# EAGLE design SolarCellX_v2_6milmag (EAGLE 9.2.2)
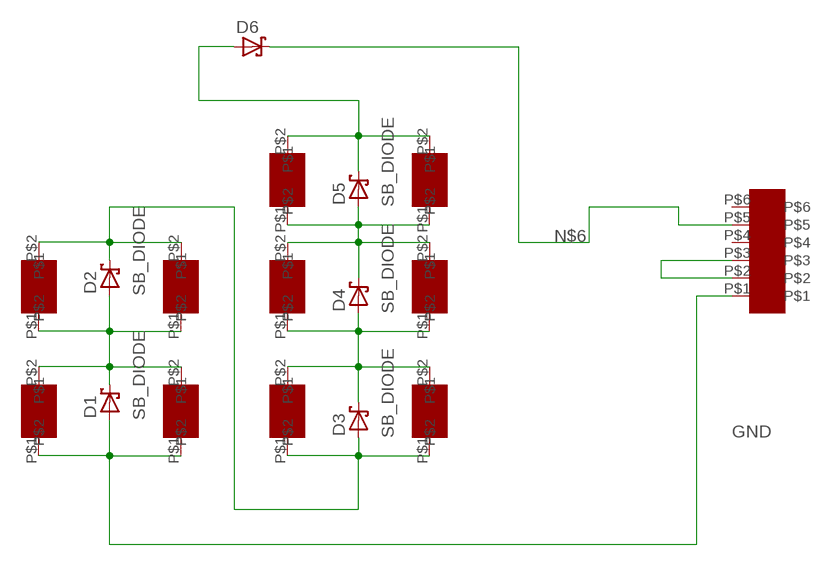
[diagram p0: schematic, sheet 1]

## Parts
1  SLMD121H04L  [SLMD121H04L]
2  SLMD121H04L  [SLMD121H04L]
11  SLMD121H04L  [SLMD121H04L]
12  SLMD121H04L  [SLMD121H04L]
13  SLMD121H04L  [SLMD121H04L]
14  SLMD121H04L  [SLMD121H04L]
21  SLMD121H04L  [SLMD121H04L]
22  SLMD121H04L  [SLMD121H04L]
23  SLMD121H04L  [SLMD121H04L]
24  SLMD121H04L  [SLMD121H04L]
D1  SB_DIODE  [SB_DIODE]
D2  SB_DIODE  [SB_DIODE]
D3  SB_DIODE  [SB_DIODE]
D4  SB_DIODE  [SB_DIODE]
D5  SB_DIODE  [SB_DIODE]
D6  SB_DIODE  [SB_DIODE]
U$1  M20-8760342  [M20-8760342]

## Nets
GND: 11.P$1 12.P$1 D1.POS U$1.P$1
N$1: U$1.P$2 U$1.P$3
N$2: 11.P$2 12.P$2 13.P$1 14.P$1 D1.NEG D2.POS
N$3: 13.P$2 14.P$2 21.P$1 22.P$1 D2.NEG D3.POS
N$4: 1.P$1 2.P$1 23.P$2 24.P$2 D4.NEG D5.POS
N$5: 21.P$2 22.P$2 23.P$1 24.P$1 D3.NEG D4.POS
N$6: D6.NEG U$1.P$5
V_SOLAR: 1.P$2 2.P$2 D5.NEG D6.POS
Unconnected: U$1.P$4 U$1.P$6

## Library data of the parts
1 2 11-14 21-24 = Solar:SLMD121H04L; HEIGHT: 2
D1-D6 = Solar:SB_DIODE
U$1 = Solar:M20-8760342; HEIGHT: 8.64

## Net classes
1 power: width 0.254 mm

## Board
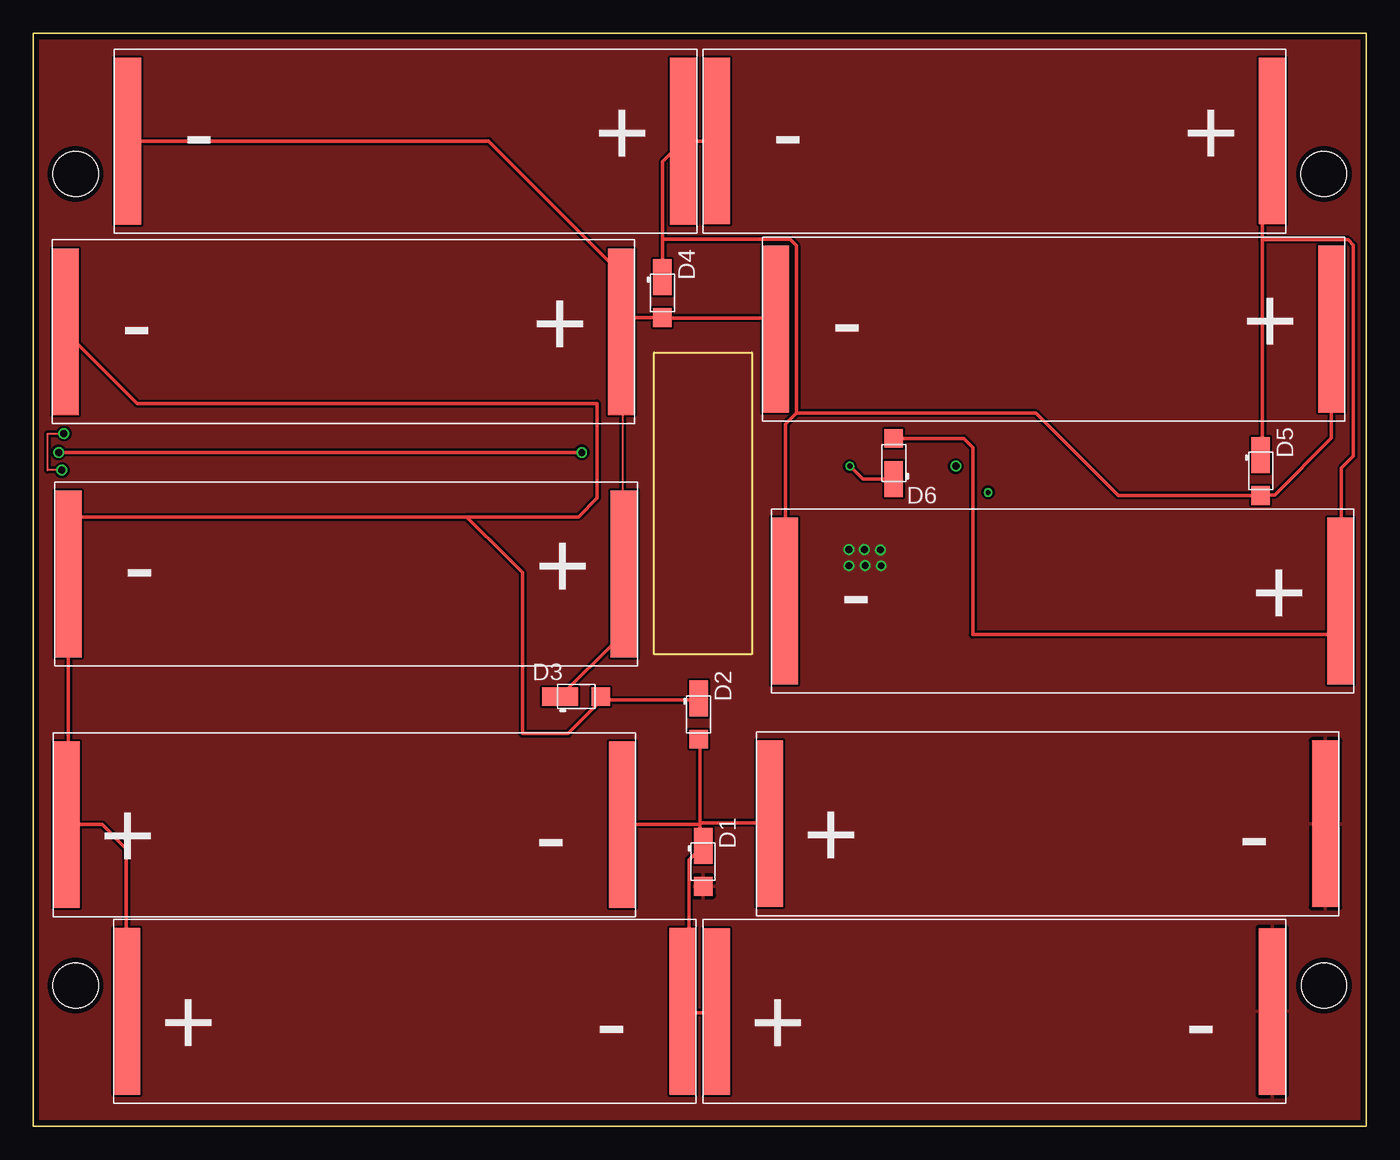
[diagram p1: board, top side]
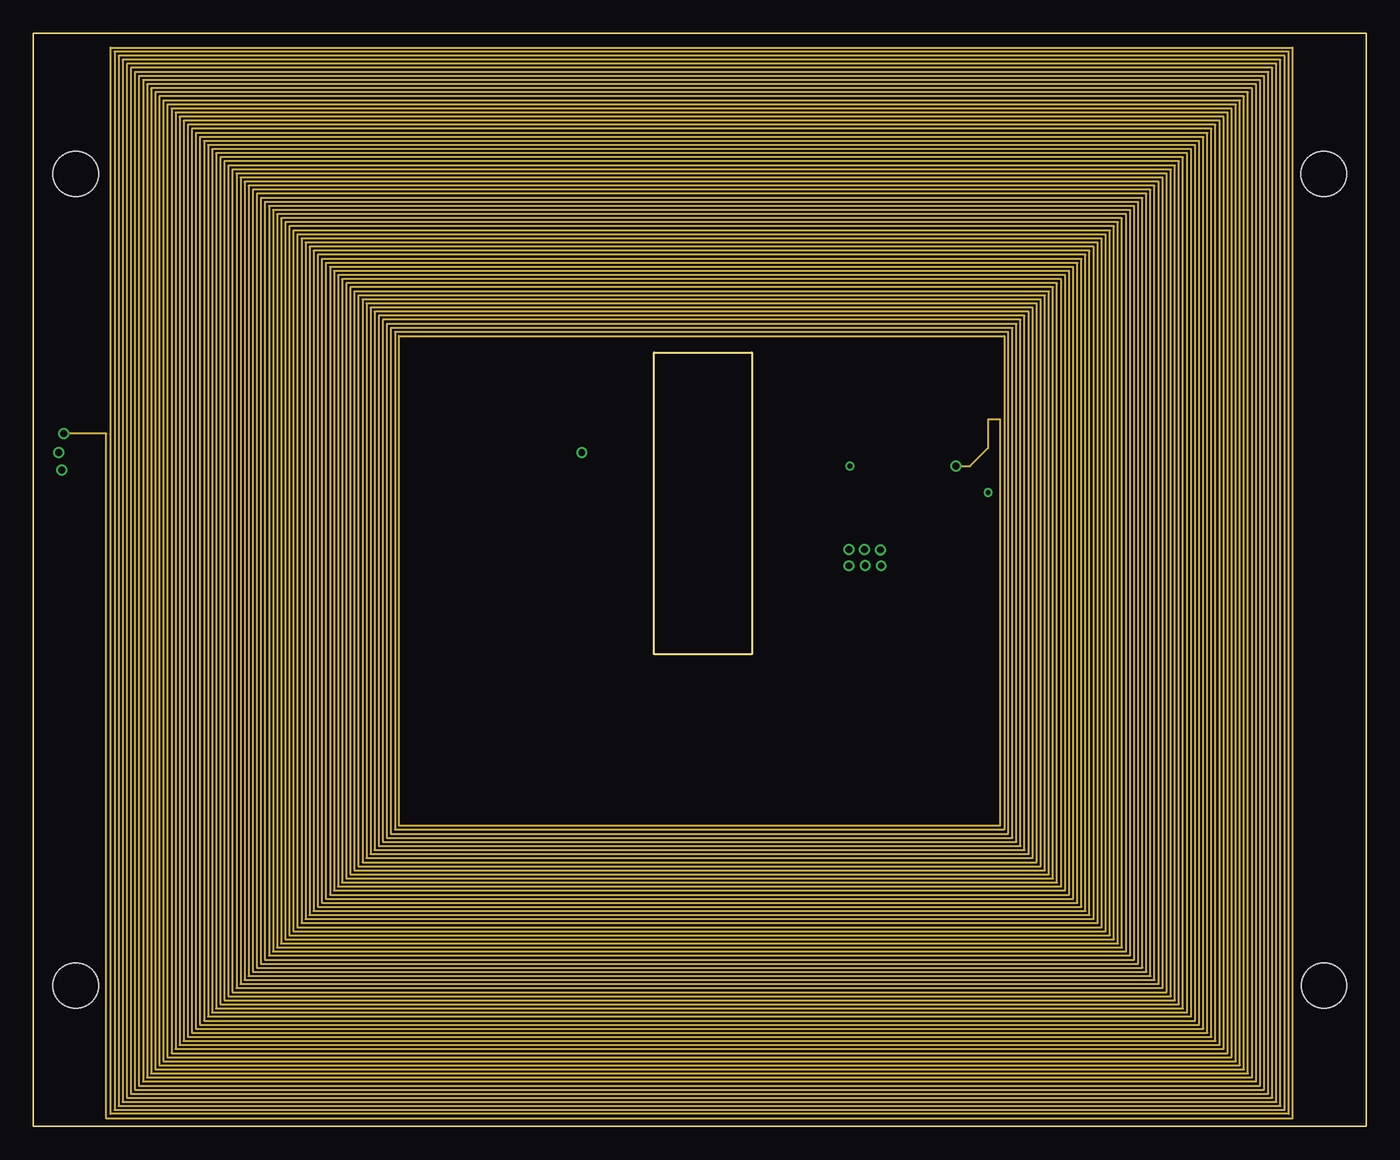
[diagram p2: board, inner layer Route2]
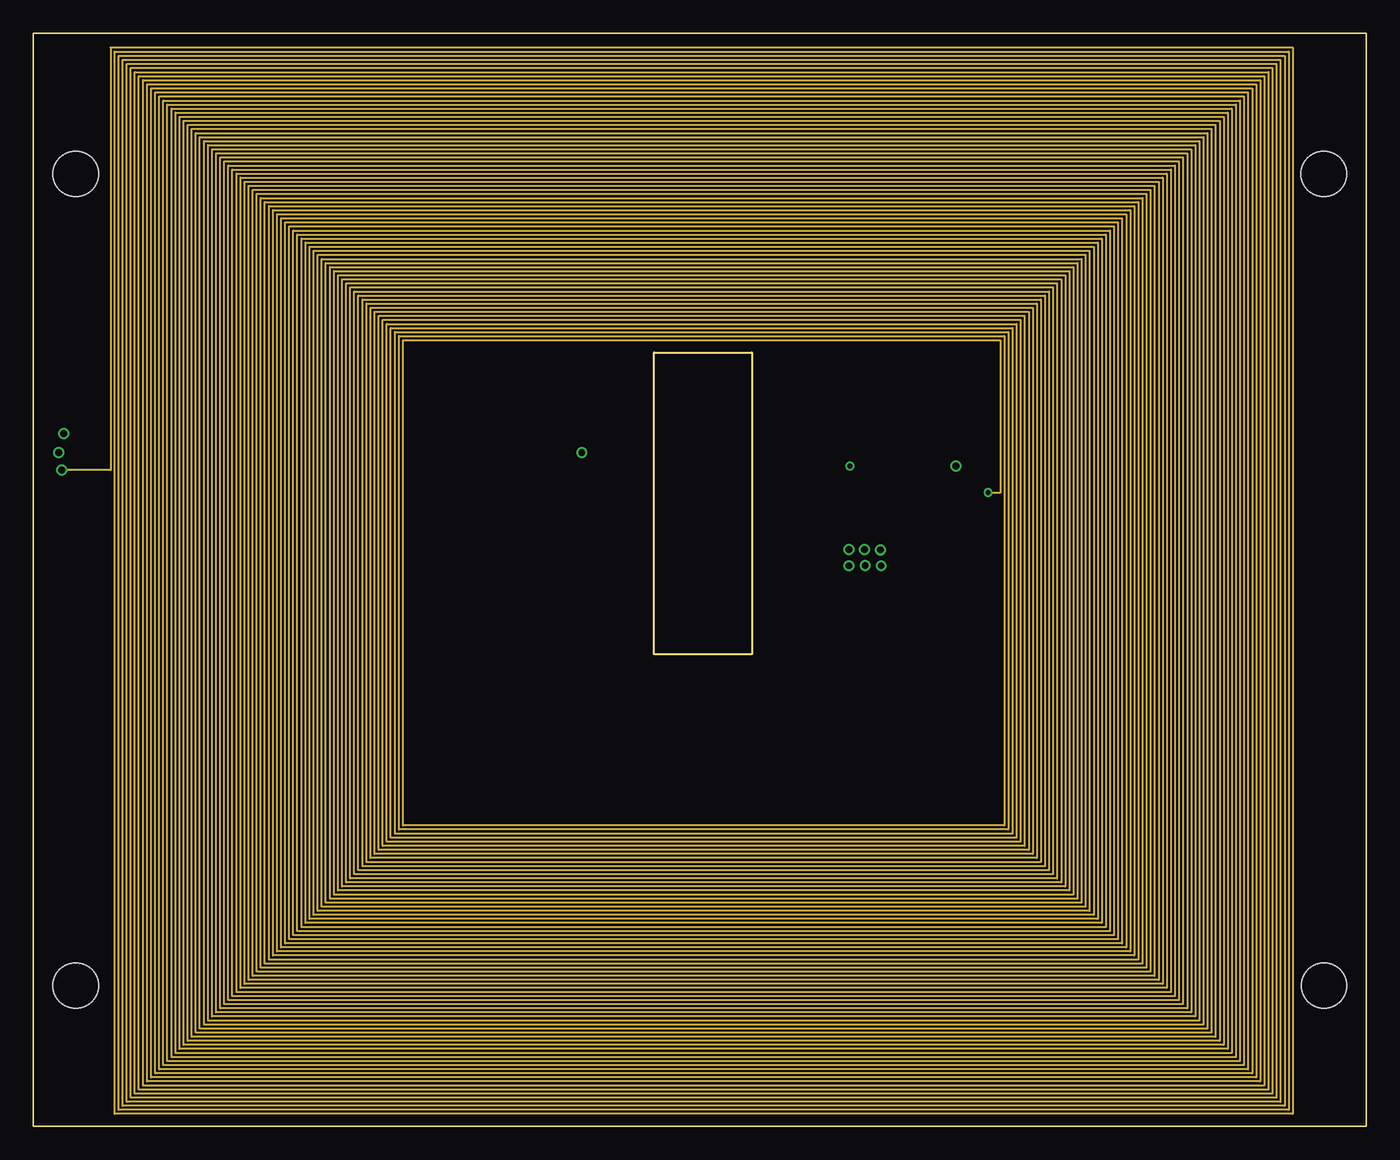
[diagram p3: board, inner layer Route15]
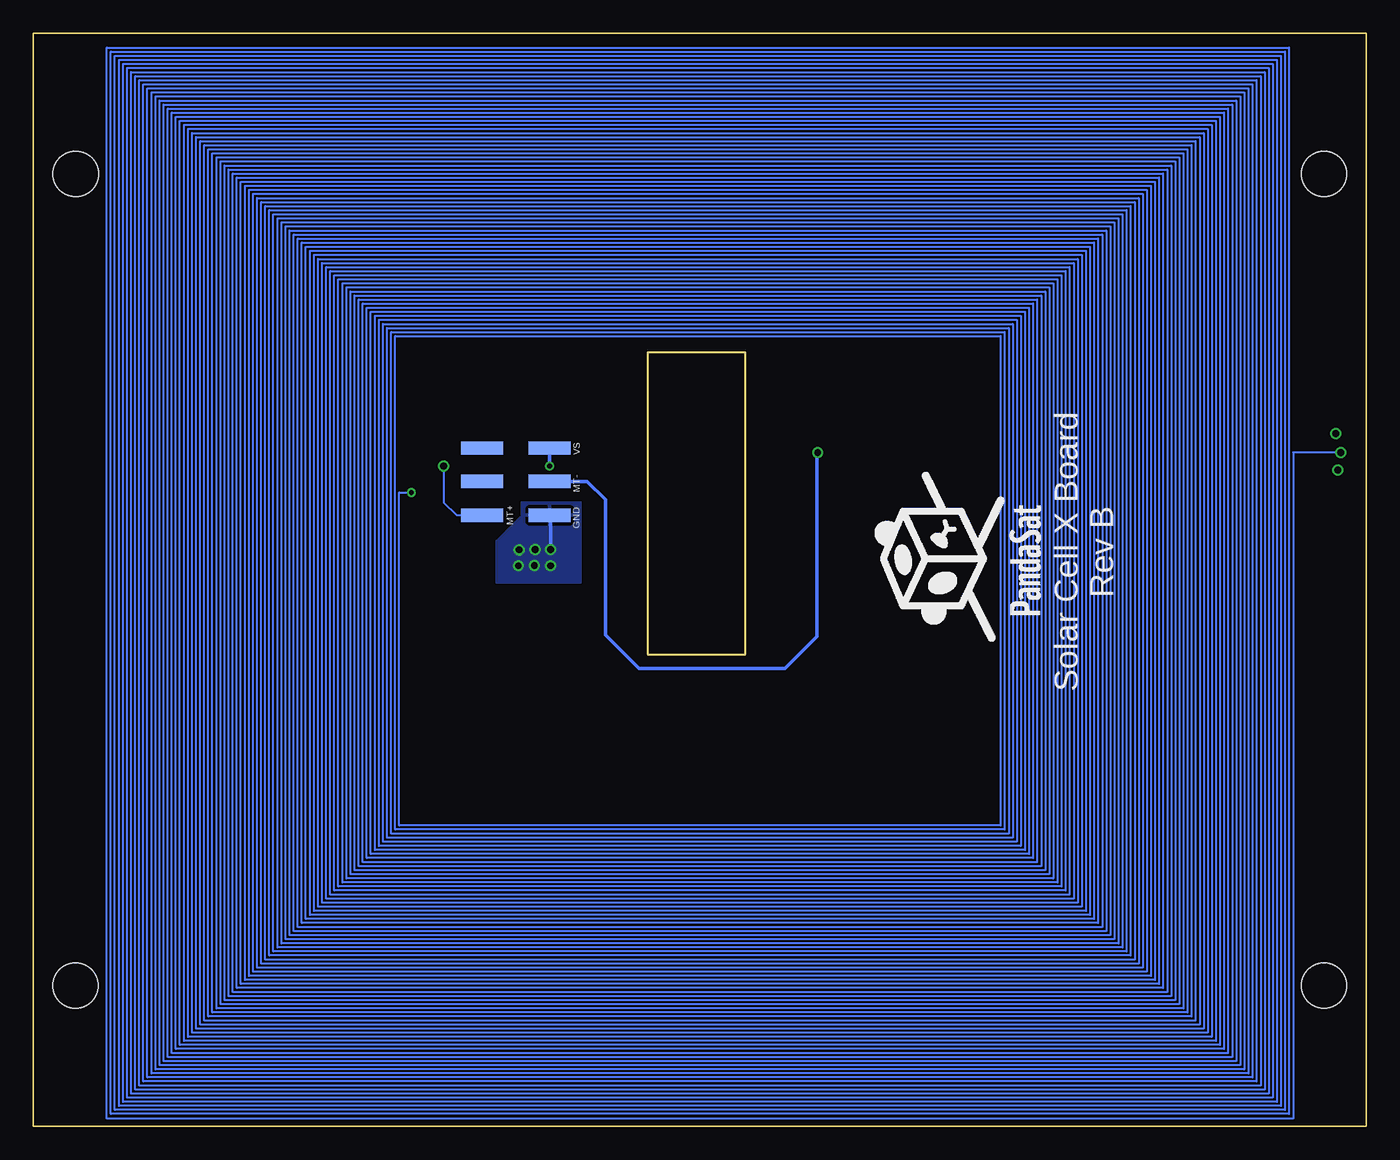
[diagram p4: board, bottom side, seen from below]

Size 100 x 82 mm. Coordinates in mm from the lower left corner, seen from the top.
Outline: 0,0 0,82 100,82 100,0 0,0
Copper layers (1*2*15*16): Top 0.035559375mm / dielectric 0.17018125mm / Route2 0.01778125mm / dielectric 47mil / Route15 0.01778125mm / dielectric 0.17018125mm / Bottom 0.035559375mm
Design rules "oshpark-4layer *": minimum track width 5mil, minimum drill 10mil, track to track 7mil, track to pad 7mil, pad to pad 7mil, via to via 7mil, smd to smd 6mil, copper to edge 15mil, drill to drill 6mil, minimum pad ring 4mil, minimum via ring 6mil, stop-mask expansion 2.5mil, vias tented up to drill 0mil, thermal gap 10mil
Holes 3.4 mm at 3.17,10.55 96.82,71.45 3.17,71.45 96.83,10.55
Milling: 4 lines

### Footprints (pad centres in the part's own frame; a part is rotated, then mirrored left to right if it is on the bottom)
SLMD121H04L = smd 2 x 12.5: P$1 1,6.9; P$2 42.7,6.9
SB_DIODE = smd 2.7 x 1.4: NEG -1.2,0 | smd 1.4 x 1.4: POS 1.85,0
M20-8760342 = smd 1 x 3.15: P$1 0.5,1.575; P$2 0.5,6.625; P$3 3.04,1.575; P$4 3.04,6.625; P$5 5.54,1.575; P$6 5.54,6.625

### Placement (x,y rotation side)
1  50.26,67.02 0 top
2  55.37,32.51 0 top
11  93.95,15.51 180 top
12  97.95,29.59 180 top
13  49.73,15.51 180 top
14  45.18,29.52 180 top
21  1.61,34.53 0 top
22  1.41,52.7 0 top
23  6.08,67.01 0 top
24  54.7,52.9 0 top
D1  50.26,19.85 270 top
D2  49.92,30.9 270 top
D3  40.73,32.23 0 top
D4  47.19,62.52 270 top
D5  92.08,49.17 270 top
D6  64.55,49.76 90 top
U$1  59.69,45.34 90 bottom

### Tracks (layer width: path | path; a pad name or v marks a point on that pad's centre or on a via)
GND  (via drill 0.5)
  Bottom 0.254: U$1.P$1 61.19,45.84 v61.19,43.26
  other vias: 62.36,43.26 63.55,43.24 61.19,42.04 62.41,42.07 63.6,42.04
  pour Top: -0.05,82.14 100.08,82.14 100.13,82.09 100.13,-0.13 -0.13,-0.13 -0.15,-0.1 -0.15,82.14
  pour Bottom: 58.93,46.84 58.93,40.77 65.25,40.77 65.25,43.92 63.35,45.82 63.35,46.84
N$1  (via drill 0.35, 0.5)
  Top 0.152: v2.13,49.23 1.07,49.23 1.07,51.97 v2.29,51.97
  Top 0.254: v41.15,50.55 v1.91,50.55
  Route2 0.152: v69.22,49.53 70.28,49.53 71.63,50.88 71.63,53.03 72.54,53.03 72.54,22.55 27.43,22.55 27.43,59.28 72.85,59.28 72.85,22.25 27.13,22.25 27.13,59.59 73.15,59.59 73.15,21.95 26.82,21.95 26.82,59.89 73.46,59.89 73.46,21.64 26.52,21.64 26.52,60.2 73.76,60.2 73.76,21.34 26.21,21.34 26.21,60.5 74.07,60.5 74.07,21.03 25.91,21.03 25.91,60.81 74.37,60.81 74.37,20.73 25.6,20.73 25.6,61.11 74.68,61.11 74.68,20.42 25.3,20.42 25.3,61.42 74.98,61.42 74.98,20.12 24.99,20.12 24.99,61.72 75.29,61.72 75.29,19.81 24.69,19.81 24.69,62.03 75.59,62.03 75.59,19.51 24.38,19.51 24.38,62.33 75.89,62.33 75.89,19.2 24.08,19.2 24.08,62.64 76.2,62.64 76.2,18.9 23.77,18.9 23.77,62.94 76.5,62.94 76.5,18.59 23.47,18.59 23.47,63.25 76.81,63.25 76.81,18.29 23.16,18.29 23.16,63.55 77.11,63.55 77.11,17.98 22.86,17.98 22.86,63.86 77.42,63.86 77.42,17.68 22.55,17.68 22.55,64.16 77.72,64.16 77.72,17.37 22.25,17.37 22.25,64.47 78.03,64.47 78.03,17.07 21.95,17.07 21.95,64.77 78.33,64.77 78.33,16.76 21.64,16.76 21.64,65.08 78.64,65.08 78.64,16.46 21.34,16.46 21.34,65.38 78.94,65.38 78.94,16.15 21.03,16.15 21.03,65.68 79.25,65.68 79.25,15.85 20.73,15.85 20.73,65.99 79.55,65.99 79.55,15.54 20.42,15.54 20.42,66.29 79.86,66.29 79.86,15.24 20.12,15.24 20.12,66.6 80.16,66.6 80.16,14.94 19.81,14.94 19.81,66.9 80.47,66.9 80.47,14.63 19.51,14.63 19.51,67.21 80.77,67.21 80.77,14.33 19.2,14.33 19.2,67.51 81.08,67.51 81.08,14.02 18.9,14.02 18.9,67.82 81.38,67.82 81.38,13.72 18.59,13.72 18.59,68.12 81.69,68.12 81.69,13.41 18.29,13.41 18.29,68.43 81.99,68.43 81.99,13.11 17.98,13.11 17.98,68.73 82.3,68.73 82.3,12.8 17.68,12.8 17.68,69.04 82.6,69.04 82.6,12.5 17.37,12.5 17.37,69.34 82.91,69.34 82.91,12.19 17.07,12.19 17.07,69.65 83.21,69.65 83.21,11.89 16.76,11.89 16.76,69.95 83.52,69.95 83.52,11.58 16.46,11.58 16.46,70.26 83.82,70.26 83.82,11.28 16.15,11.28 16.15,70.56 84.12,70.56 84.12,10.97 15.85,10.97 15.85,70.87 84.43,70.87 84.43,10.67 15.54,10.67 15.54,71.17 84.73,71.17 84.73,10.36 15.24,10.36 15.24,71.48 85.04,71.48 85.04,10.06 14.94,10.06 14.94,71.78 85.34,71.78 85.34,9.75 14.63,9.75 14.63,72.08 85.65,72.08 85.65,9.45 14.33,9.45 14.33,72.39 85.95,72.39 85.95,9.14 14.02,9.14 14.02,72.69 86.26,72.69 86.26,8.84 13.72,8.84 13.72,73 86.56,73 86.56,8.53 13.41,8.53 13.41,73.3 86.87,73.3 86.87,8.23 13.11,8.23 13.11,73.61 87.17,73.61 87.17,7.92 12.8,7.92 12.8,73.91 87.48,73.91 87.48,7.62 12.5,7.62 12.5,74.22 87.78,74.22 87.78,7.32 12.19,7.32 12.19,74.52 88.09,74.52 88.09,7.01 11.89,7.01 11.89,74.83 88.39,74.83 88.39,6.71 11.58,6.71 11.58,75.13 88.7,75.13 88.7,6.4 11.28,6.4 11.28,75.44 89,75.44 89,6.1 10.97,6.1 10.97,75.74 89.31,75.74 89.31,5.79 10.67,5.79 10.67,76.05 89.61,76.05 89.61,5.49 10.36,5.49 10.36,76.35 89.92,76.35 89.92,5.18 10.06,5.18 10.06,76.66 90.22,76.66 90.22,4.88 9.75,4.88 9.75,76.96 90.53,76.96 90.53,4.57 9.45,4.57 9.45,77.27 90.83,77.27 90.83,4.27 9.14,4.27 9.14,77.57 91.14,77.57 91.14,3.96 8.84,3.96 8.84,77.88 91.44,77.88 91.44,3.66 8.53,3.66 8.53,78.18 91.75,78.18 91.75,3.35 8.23,3.35 8.23,78.49 92.05,78.49 92.05,3.05 7.92,3.05 7.92,78.79 92.35,78.79 92.35,2.74 7.62,2.74 7.62,79.1 92.66,79.1 92.66,2.44 7.32,2.44 7.32,79.4 92.96,79.4 92.96,2.13 7.01,2.13 7.01,79.7 93.27,79.7 93.27,1.83 6.71,1.83 6.71,80.01 93.57,80.01 93.57,1.52 6.4,1.52 6.4,80.31 93.88,80.31 93.88,1.22 6.1,1.22 6.1,80.62 94.18,80.62 94.18,0.91 5.79,0.91 5.79,80.92 94.49,80.92 94.49,0.57 5.49,0.57 5.49,51.97 v2.29,51.97
  Route15 0.152: v2.13,49.23 5.79,49.23 5.79,80.92 94.49,80.92 94.49,0.91 6.1,0.91 6.1,80.62 94.18,80.62 94.18,1.22 6.4,1.22 6.4,80.31 93.88,80.31 93.88,1.52 6.71,1.52 6.71,80.01 93.57,80.01 93.57,1.83 7.01,1.83 7.01,79.7 93.27,79.7 93.27,2.13 7.32,2.13 7.32,79.4 92.96,79.4 92.96,2.44 7.62,2.44 7.62,79.1 92.66,79.1 92.66,2.74 7.92,2.74 7.92,78.79 92.35,78.79 92.35,3.05 8.23,3.05 8.23,78.49 92.05,78.49 92.05,3.35 8.53,3.35 8.53,78.18 91.75,78.18 91.75,3.66 8.84,3.66 8.84,77.88 91.44,77.88 91.44,3.96 9.14,3.96 9.14,77.57 91.14,77.57 91.14,4.27 9.45,4.27 9.45,77.27 90.83,77.27 90.83,4.57 9.75,4.57 9.75,76.96 90.53,76.96 90.53,4.88 10.06,4.88 10.06,76.66 90.22,76.66 90.22,5.18 10.36,5.18 10.36,76.35 89.92,76.35 89.92,5.49 10.67,5.49 10.67,76.05 89.61,76.05 89.61,5.79 10.97,5.79 10.97,75.74 89.31,75.74 89.31,6.1 11.28,6.1 11.28,75.44 89,75.44 89,6.4 11.58,6.4 11.58,75.13 88.7,75.13 88.7,6.71 11.89,6.71 11.89,74.83 88.39,74.83 88.39,7.01 12.19,7.01 12.19,74.52 88.09,74.52 88.09,7.32 12.5,7.32 12.5,74.22 87.78,74.22 87.78,7.62 12.8,7.62 12.8,73.91 87.48,73.91 87.48,7.92 13.11,7.92 13.11,73.61 87.17,73.61 87.17,8.23 13.41,8.23 13.41,73.3 86.87,73.3 86.87,8.53 13.72,8.53 13.72,73 86.56,73 86.56,8.84 14.02,8.84 14.02,72.69 86.26,72.69 86.26,9.14 14.33,9.14 14.33,72.39 85.95,72.39 85.95,9.45 14.63,9.45 14.63,72.08 85.65,72.08 85.65,9.75 14.94,9.75 14.94,71.78 85.34,71.78 85.34,10.06 15.24,10.06 15.24,71.48 85.04,71.48 85.04,10.36 15.54,10.36 15.54,71.17 84.73,71.17 84.73,10.67 15.85,10.67 15.85,70.87 84.43,70.87 84.43,10.97 16.15,10.97 16.15,70.56 84.12,70.56 84.12,11.28 16.46,11.28 16.46,70.26 83.82,70.26 83.82,11.58 16.76,11.58 16.76,69.95 83.52,69.95 83.52,11.89 17.07,11.89 17.07,69.65 83.21,69.65 83.21,12.19 17.37,12.19 17.37,69.34 82.91,69.34 82.91,12.5 17.68,12.5 17.68,69.04 82.6,69.04 82.6,12.8 17.98,12.8 17.98,68.73 82.3,68.73 82.3,13.11 18.29,13.11 18.29,68.43 81.99,68.43 81.99,13.41 18.59,13.41 18.59,68.12 81.69,68.12 81.69,13.72 18.9,13.72 18.9,67.82 81.38,67.82 81.38,14.02 19.2,14.02 19.2,67.51 81.08,67.51 81.08,14.33 19.51,14.33 19.51,67.21 80.77,67.21 80.77,14.63 19.81,14.63 19.81,66.9 80.47,66.9 80.47,14.94 20.12,14.94 20.12,66.6 80.16,66.6 80.16,15.24 20.42,15.24 20.42,66.29 79.86,66.29 79.86,15.54 20.73,15.54 20.73,65.99 79.55,65.99 79.55,15.85 21.03,15.85 21.03,65.68 79.25,65.68 79.25,16.15 21.34,16.15 21.34,65.38 78.94,65.38 78.94,16.46 21.64,16.46 21.64,65.08 78.64,65.08 78.64,16.76 21.95,16.76 21.95,64.77 78.33,64.77 78.33,17.07 22.25,17.07 22.25,64.47 78.03,64.47 78.03,17.37 22.55,17.37 22.55,64.16 77.72,64.16 77.72,17.68 22.86,17.68 22.86,63.86 77.42,63.86 77.42,17.98 23.16,17.98 23.16,63.55 77.11,63.55 77.11,18.29 23.47,18.29 23.47,63.25 76.81,63.25 76.81,18.59 23.77,18.59 23.77,62.94 76.5,62.94 76.5,18.9 24.08,18.9 24.08,62.64 76.2,62.64 76.2,19.2 24.38,19.2 24.38,62.33 75.89,62.33 75.89,19.51 24.69,19.51 24.69,62.03 75.59,62.03 75.59,19.81 24.99,19.81 24.99,61.72 75.29,61.72 75.29,20.12 25.3,20.12 25.3,61.42 74.98,61.42 74.98,20.42 25.6,20.42 25.6,61.11 74.68,61.11 74.68,20.73 25.91,20.73 25.91,60.81 74.37,60.81 74.37,21.03 26.21,21.03 26.21,60.5 74.07,60.5 74.07,21.34 26.52,21.34 26.52,60.2 73.76,60.2 73.76,21.64 26.82,21.64 26.82,59.89 73.46,59.89 73.46,21.95 27.13,21.95 27.13,59.59 73.15,59.59 73.15,22.25 27.43,22.25 27.43,59.28 72.85,59.28 72.85,22.55 27.74,22.55 27.74,58.98 72.54,58.98 72.54,47.52 71.63,47.52 v71.63,47.55
  Bottom 0.152: v1.91,50.55 5.49,50.55 5.49,0.57 94.49,0.57 94.49,80.92 5.79,80.92 5.79,0.91 94.18,0.91 94.18,80.62 6.1,80.62 6.1,1.22 93.88,1.22 93.88,80.31 6.4,80.31 6.4,1.52 93.57,1.52 93.57,80.01 6.71,80.01 6.71,1.83 93.27,1.83 93.27,79.7 7.01,79.7 7.01,2.13 92.96,2.13 92.96,79.4 7.32,79.4 7.32,2.44 92.66,2.44 92.66,79.1 7.62,79.1 7.62,2.74 92.35,2.74 92.35,78.79 7.92,78.79 7.92,3.05 92.05,3.05 92.05,78.49 8.23,78.49 8.23,3.35 91.75,3.35 91.75,78.18 8.53,78.18 8.53,3.66 91.44,3.66 91.44,77.88 8.84,77.88 8.84,3.96 91.14,3.96 91.14,77.57 9.14,77.57 9.14,4.27 90.83,4.27 90.83,77.27 9.45,77.27 9.45,4.57 90.53,4.57 90.53,76.96 9.75,76.96 9.75,4.88 90.22,4.88 90.22,76.66 10.06,76.66 10.06,5.18 89.92,5.18 89.92,76.35 10.36,76.35 10.36,5.49 89.61,5.49 89.61,76.05 10.67,76.05 10.67,5.79 89.31,5.79 89.31,75.74 10.97,75.74 10.97,6.1 89,6.1 89,75.44 11.28,75.44 11.28,6.4 88.7,6.4 88.7,75.13 11.58,75.13 11.58,6.71 88.39,6.71 88.39,74.83 11.89,74.83 11.89,7.01 88.09,7.01 88.09,74.52 12.19,74.52 12.19,7.32 87.78,7.32 87.78,74.22 12.5,74.22 12.5,7.62 87.48,7.62 87.48,73.91 12.8,73.91 12.8,7.92 87.17,7.92 87.17,73.61 13.11,73.61 13.11,8.23 86.87,8.23 86.87,73.3 13.41,73.3 13.41,8.53 86.56,8.53 86.56,73 13.72,73 13.72,8.84 86.26,8.84 86.26,72.69 14.02,72.69 14.02,9.14 85.95,9.14 85.95,72.39 14.33,72.39 14.33,9.45 85.65,9.45 85.65,72.08 14.63,72.08 14.63,9.75 85.34,9.75 85.34,71.78 14.94,71.78 14.94,10.06 85.04,10.06 85.04,71.48 15.24,71.48 15.24,10.36 84.73,10.36 84.73,71.17 15.54,71.17 15.54,10.67 84.43,10.67 84.43,70.87 15.85,70.87 15.85,10.97 84.12,10.97 84.12,70.56 16.15,70.56 16.15,11.28 83.82,11.28 83.82,70.26 16.46,70.26 16.46,11.58 83.52,11.58 83.52,69.95 16.76,69.95 16.76,11.89 83.21,11.89 83.21,69.65 17.07,69.65 17.07,12.19 82.91,12.19 82.91,69.34 17.37,69.34 17.37,12.5 82.6,12.5 82.6,69.04 17.68,69.04 17.68,12.8 82.3,12.8 82.3,68.73 17.98,68.73 17.98,13.11 81.99,13.11 81.99,68.43 18.29,68.43 18.29,13.41 81.69,13.41 81.69,68.12 18.59,68.12 18.59,13.72 81.38,13.72 81.38,67.82 18.9,67.82 18.9,14.02 81.08,14.02 81.08,67.51 19.2,67.51 19.2,14.33 80.77,14.33 80.77,67.21 19.51,67.21 19.51,14.63 80.47,14.63 80.47,66.9 19.81,66.9 19.81,14.94 80.16,14.94 80.16,66.6 20.12,66.6 20.12,15.24 79.86,15.24 79.86,66.29 20.42,66.29 20.42,15.54 79.55,15.54 79.55,65.99 20.73,65.99 20.73,15.85 79.25,15.85 79.25,65.68 21.03,65.68 21.03,16.15 78.94,16.15 78.94,65.38 21.34,65.38 21.34,16.46 78.64,16.46 78.64,65.08 21.64,65.08 21.64,16.76 78.33,16.76 78.33,64.77 21.95,64.77 21.95,17.07 78.03,17.07 78.03,64.47 22.25,64.47 22.25,17.37 77.72,17.37 77.72,64.16 22.55,64.16 22.55,17.68 77.42,17.68 77.42,63.86 22.86,63.86 22.86,17.98 77.11,17.98 77.11,63.55 23.16,63.55 23.16,18.29 76.81,18.29 76.81,63.25 23.47,63.25 23.47,18.59 76.5,18.59 76.5,62.94 23.77,62.94 23.77,18.9 76.2,18.9 76.2,62.64 24.08,62.64 24.08,19.2 75.89,19.2 75.89,62.33 24.38,62.33 24.38,19.51 75.59,19.51 75.59,62.03 24.69,62.03 24.69,19.81 75.29,19.81 75.29,61.72 24.99,61.72 24.99,20.12 74.98,20.12 74.98,61.42 25.3,61.42 25.3,20.42 74.68,20.42 74.68,61.11 25.6,61.11 25.6,20.73 74.37,20.73 74.37,60.81 25.91,60.81 25.91,21.03 74.07,21.03 74.07,60.5 26.21,60.5 26.21,21.34 73.76,21.34 73.76,60.2 26.52,60.2 26.52,21.64 73.46,21.64 73.46,59.89 26.82,59.89 26.82,21.95 73.15,21.95 73.15,59.59 27.13,59.59 27.13,22.25 72.85,22.25 72.85,59.28 27.43,59.28 27.43,22.55 72.54,22.55 72.54,47.55 v71.63,47.55
  Bottom 0.152: U$1.P$2 68.24,45.84 69.22,46.81 v69.22,49.53
  Bottom 0.254: v41.15,50.55 41.2,50.55 41.2,36.75 43.62,34.33 54.56,34.33 57.08,36.85 57.08,47.02 58.45,48.38 U$1.P$3
N$2
  Top 0.152: 51.83,8.52 11.P$2 | 50.01,22.63 50.01,22.77 | 50.01,21.23 50.15,21.09 D1.NEG | 50.01,28.92 D2.POS | 55.18,22.77 12.P$2 | 44.28,22.63 14.P$1 | 49.31,8.52 49.19,8.52 48.76,8.52 13.P$1 49.31,8.52
  Top 0.254: 51.83,8.52 49.31,8.52 | 50.01,21.23 50.01,22.63 44.28,22.63 | 50.01,28.92 50.01,22.77 55.18,22.77 | 49.19,8.52 49.19,19.99 50.25,21.05 D1.NEG
N$3
  Top 0.152: 49.87,31.99 D2.NEG | 42.49,31.99 D3.POS 42.7,32.23 42.8,32.13 | 6.99,8.66 13.P$2 | 2.52,22.63 2.52,23.52 2.48,23.55 14.P$2 2.48,28.26 2.54,28.32 | 21.P$1 2.55,41.49 2.41,41.63 2.41,45.72
  Top 0.254: 2.52,22.63 5.17,22.63 6.99,20.82 6.99,8.66 | 42.49,31.99 49.87,31.99 | 22.P$1 7.78,54.23 42.29,54.23 42.29,47.12 40.89,45.72 32.51,45.72 | 2.41,45.72 32.51,45.72 | 21.P$1 2.61,28.39 2.54,28.32 | 32.51,45.72 35.61,42.62 36.7,41.53 36.7,29.46 40.13,29.46 42.8,32.13
N$4
  Top 0.152: 97.37,59.79 24.P$2 | 47.22,63.84 D4.NEG | 48.48,73.62 23.P$2 48.62,73.76 48.76,73.9 | 56.44,36.88 2.P$1 | 51.69,73.9 1.P$1
  Top 0.254: 97.37,59.79 97.37,51.61 93.13,47.37 92.03,47.37 D5.POS 81.4,47.32 75.22,53.51 57.25,53.51 | 47.22,66.56 47.22,72.36 48.48,73.62 | 47.22,66.56 47.22,63.84 | 56.44,36.88 56.44,52.69 57.25,53.51 | 57.25,53.51 57.25,66.08 56.77,66.56 47.22,66.56 | 48.76,73.9 51.69,73.9
N$5
  Top 0.152: 54.9,60.63 55.6,59.93 24.P$1 | 47.22,60.63 D4.POS | 44.2,41.35 44.15,41.35 21.P$2 | 44.07,64.01 44.2,64.01 44.11,63.92 22.P$2 | 44.2,41.35 44.28,41.35 44.31,41.38 21.P$2 | 44.2,59.6 44.2,41.35 | 22.P$2 44.2,59.6 | 44.2,59.6 44.2,60.33 | 44.2,60.33 44.2,60.67 | 22.P$2 44.11,60.23 44.2,60.33 | 21.P$2 43.81,40.93 43.81,38.61
  Top 0.254: 54.9,60.63 47.22,60.63 | D3.NEG 43.81,36.52 43.81,38.61 | D4.POS 44.2,60.67 | 23.P$1 34.17,73.91 44.07,64.01
N$6  (via drill 0.35)
  Top 0.254: D6.NEG 62.23,48.56 v61.27,49.53
  Bottom 0.254: v61.27,49.53 | v61.27,49.53 U$1.P$5
V_SOLAR
  Top 0.152: 92.2,50.45 D5.NEG | 93.46,73.9 1.P$2 | 98.07,36.88 2.P$2 98.08,39.31
  Top 0.254: 92.2,66.51 92.2,72.64 93.46,73.9 | 92.2,66.51 92.2,50.45 | 98.07,36.88 70.48,36.88 70.48,50.93 69.8,51.61 D6.POS | 92.2,66.51 98.64,66.51 99.03,66.12 99.03,50.27 98.15,49.38 98.15,39.38 98.08,39.31

### Text on the board
bPlace: VS | MT- | MT+ | GND | Solar Cell X Board / Rev B